# EAGLE design LoRa-E5-Tiny (EAGLE 7.7.0)
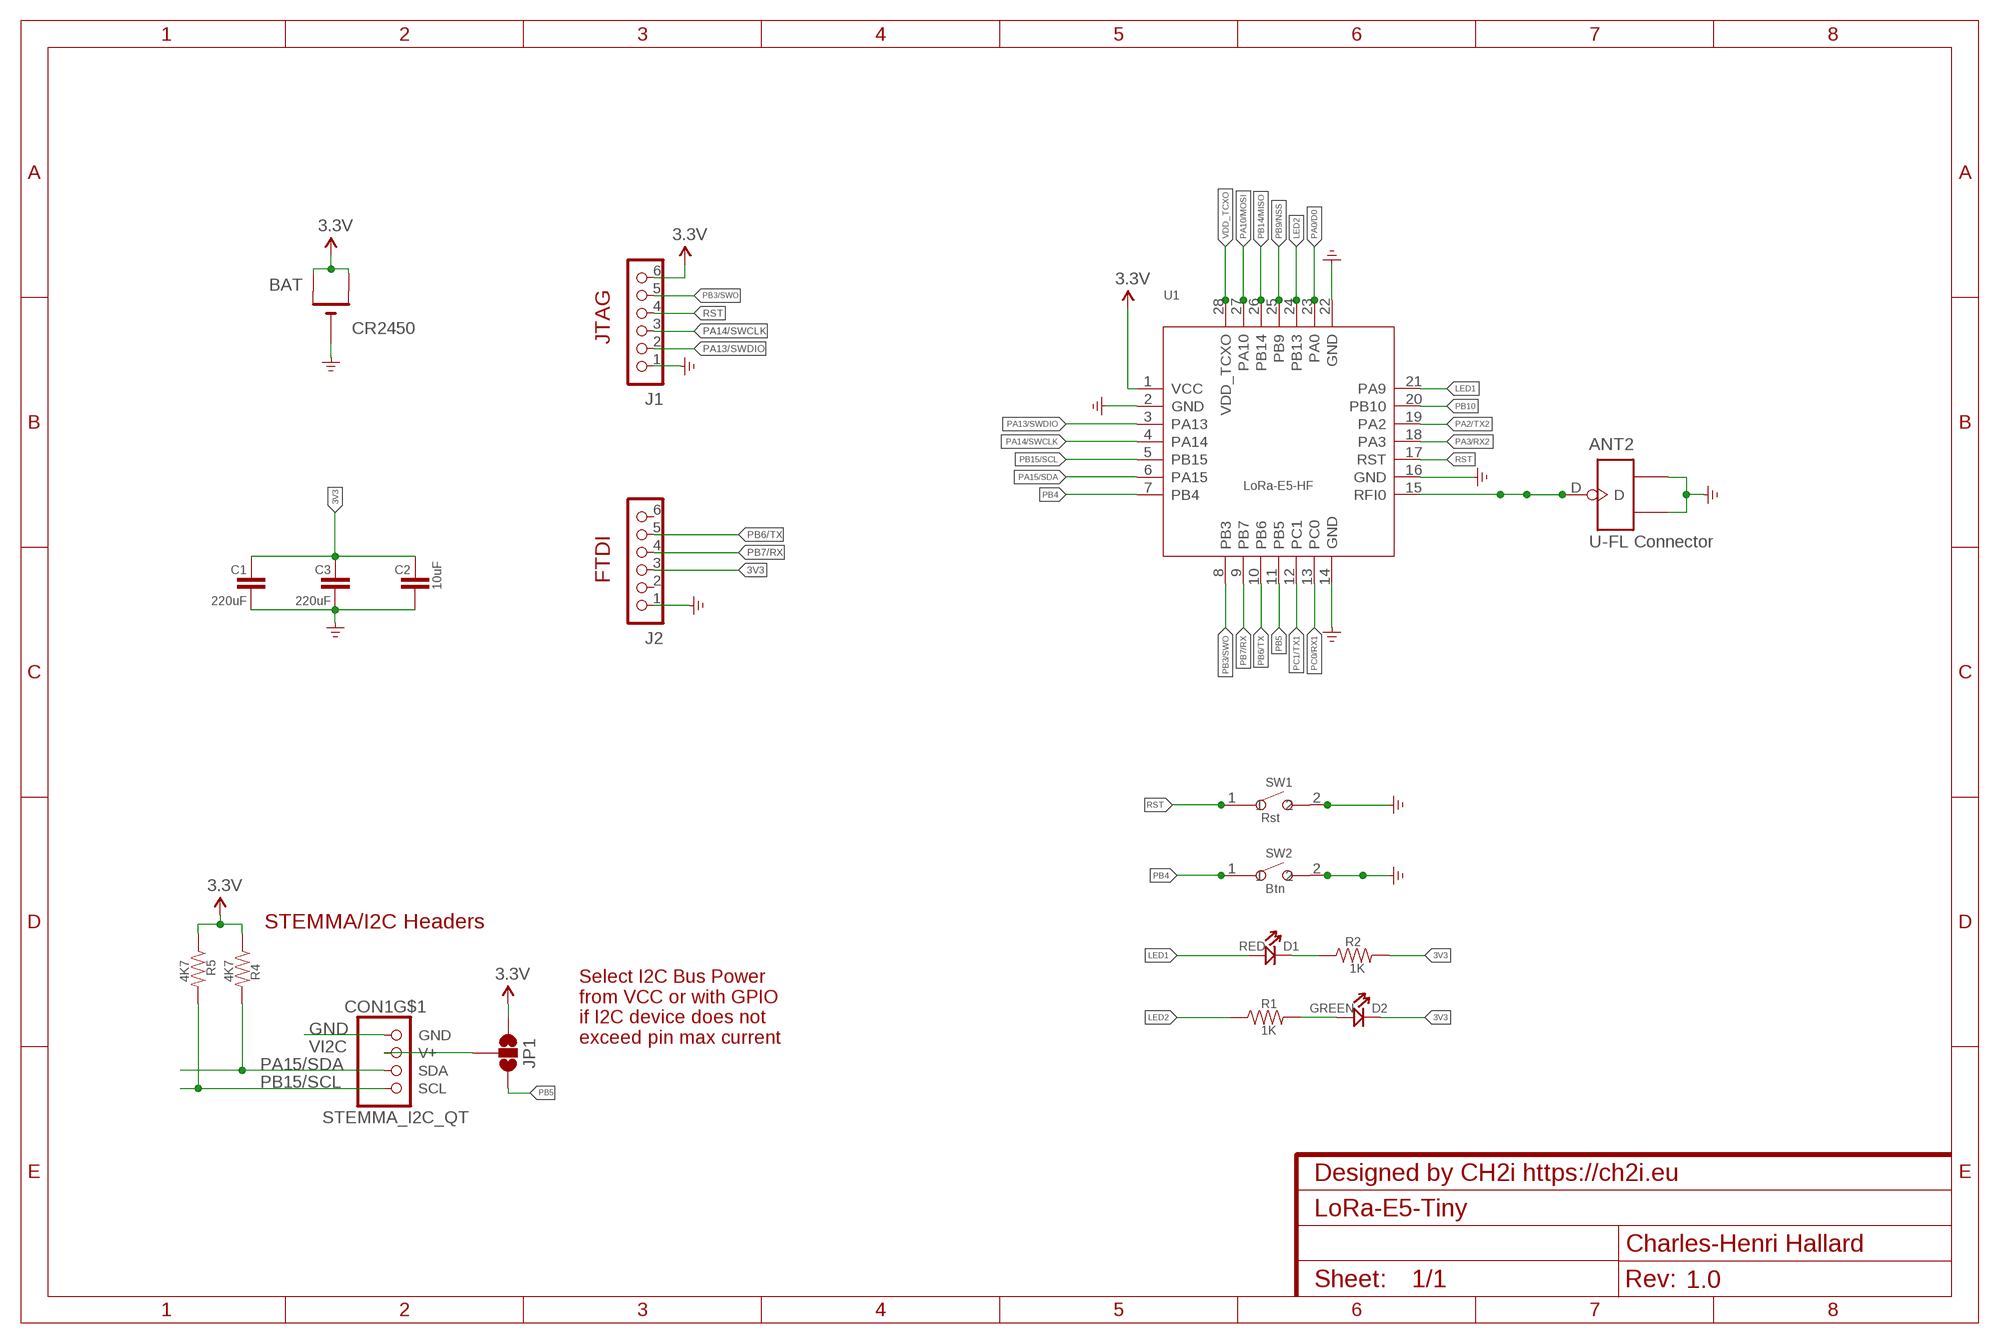
[diagram p0: schematic, sheet 1]
NAME (FRAME-A4L): CNAME: Designed by CH2i https://ch2i.eu; CREVISION: 1.0; DESIGNER: Charles-Henri Hallard

## Parts
ANT2  U-FL Connector  ANTENNA-U-FL-320110048  [U-FL3P-SMD-2.6X2.6X1.0MM]
BAT  CR2450  CR2450THM  [CR2450-THM]
C1  220uF  CAP1206  [1206]
C2  10uF  CAP0603-CAP  [0603-CAP]
C3  220uF  CAP1206  [1206]
CON1  STEMMA_I2C_QT  [JST_SH4]
D1  RED  LED'0805'  [LED-0805]
D2  GREEN  LED'0805'  [LED-0805]
J1  JTAG  CON_HEADER_1X06PAD  [M1X06_PAD]
J2  FTDI  CON_HEADER_1X06PAD  [M1X06_PAD]
JP1  JUMPER-SMT_3_NO_NO-SILK  [SMT-JUMPER_3_NO_NO-SILK]
R1  1K  RESISTOR0603-RES  [0603-RES]
R2  1K  RESISTOR0603-RES  [0603-RES]
R4  4K7  RESISTOR0603-RES  [0603-RES]
R5  4K7  RESISTOR0603-RES  [0603-RES]
SW1  Rst  SMD-BUTTON(2P-3.0X2.5X1.2+0.4MM)-B3U-1000P-2P-SMD  [SW2-2.6-3.0X2.5X1.2+0.4MM]
SW2  Btn  SMD-BUTTON(2P-3.0X2.5X1.2+0.4MM)-B3U-1000P-2P-SMD  [SW2-2.6-3.0X2.5X1.2+0.4MM]
U1  LoRa-E5-HF  MOUDLE_LORA_E5  [MOUDLE28P-1.25-12X12X2.5MM]

## Nets
3V3: BAT.+1(+) BAT.+2(+1) C1.2 C2.2 C3.2 D2.- J1.6 J2.3 JP1.1 R2.2 R4.1 R5.1 U1.1(VCC) ; supply symbol labelled 3.3V
GND: ANT2.GND1 ANT2.GND2 BAT.GND(-) C1.1 C2.1 C3.1 CON1.1(GND) J1.1 J2.1 SW1.2 SW2.2 U1.2(GND) U1.14(GND) U1.16(GND) U1.22(GND) ; supply symbol labelled GND_POWER
LED1: D1.+ U1.21(PA9)
LED2: R1.1 U1.24(PB13)
N$2: D2.+ R1.2
N$12: D1.- R2.1
PA0/D0: U1.23(PA0)
PA2/TX2: U1.19(PA2)
PA3/RX2: U1.18(PA3)
PA10/MOSI: U1.27(PA10)
PA13/SWDIO: J1.2 U1.3(PA13)
PA14/SWCLK: J1.3 U1.4(PA14)
PA15/SDA: CON1.3(SDA) R4.2 U1.6(PA15)
PB3/SWO: J1.5 U1.8(PB3)
PB4: SW2.1 U1.7(PB4)
PB5: JP1.3 U1.11(PB5)
PB6/TX: J2.5 U1.10(PB6)
PB7/RX: J2.4 U1.9(PB7)
PB9/NSS: U1.25(PB9)
PB10: U1.20(PB10)
PB14/MISO: U1.26(PB14)
PB15/SCL: CON1.4(SCL) R5.2 U1.5(PB15)
PC0/RX1: U1.13(PC0)
PC1/TX1: U1.12(PC1)
RF: ANT2.D U1.15(RFI0)
RST: J1.4 SW1.1 U1.17(RST)
VDD_TCXO: U1.28(VDD_TCXO)
VI2C: CON1.2(V+) JP1.2
Unconnected: CON1.MT1(MT) CON1.MT2(MT) J2.2 J2.6

## Notes on the sheet
- JTAG
- FTDI
- STEMMA/I2C Headers
- Select I2C Bus Power
  from VCC or with GPIO
  if I2C device does not
  exceed pin max current

## Library data of the parts
ANT2 = Connector-new:ANTENNA-U-FL
BAT = _c2h:CR2450
C1-C3 = _c2h:CAP: Capacitor Standard 0603 ceramic capacitor, and 0.1" leaded capacitor.
CON1 = microbuilder:STEMMA_I2C
D1 D2 = Discrete-new:LED
J1 J2 = _c2h:CON_HEADER_1X06
JP1 = SparkFun-Jumpers:JUMPER-SMT_3_NO: Normally open jumper This jumper has three pads in close proximity to each other. Apply solder to close the connection(s).
R1 R2 R4 R5 = _c2h:RESISTOR: Resistor Basic schematic elements and footprints for 0603, 1206, and PTH resistors.
SW1 SW2 = Seeed-Switch:SMD-BUTTON(2P-3.0X2.5X1.2+0.4MM): 311020047; MPN: B3U-1000P-2P-SMD; VALUE: B3U-1000P-2P-SMD
U1 = moudle-new:MOUDLE_LORA_E5

## Board
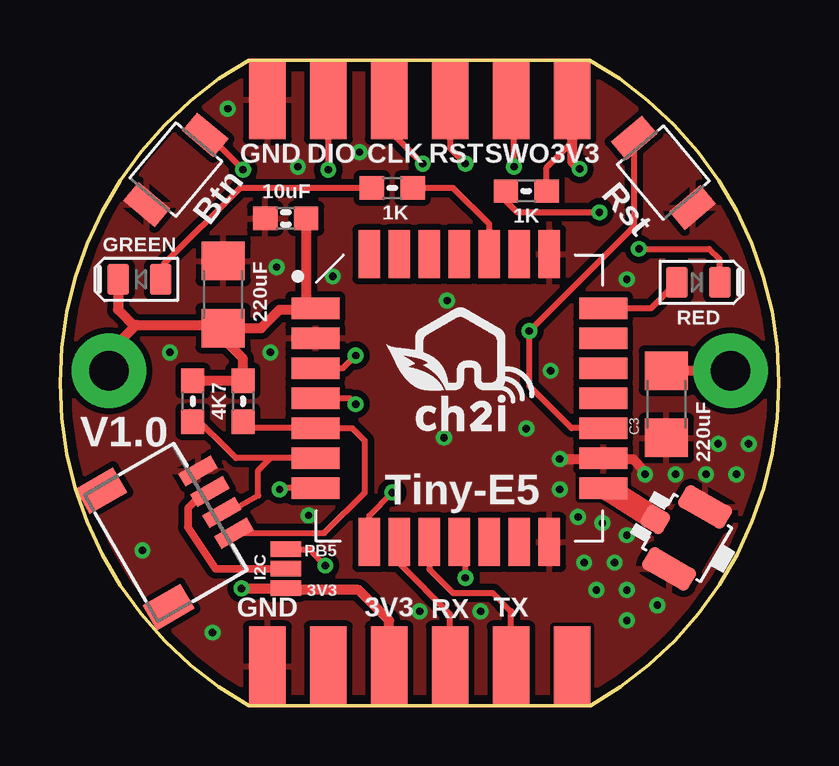
[diagram p1: board, top side]
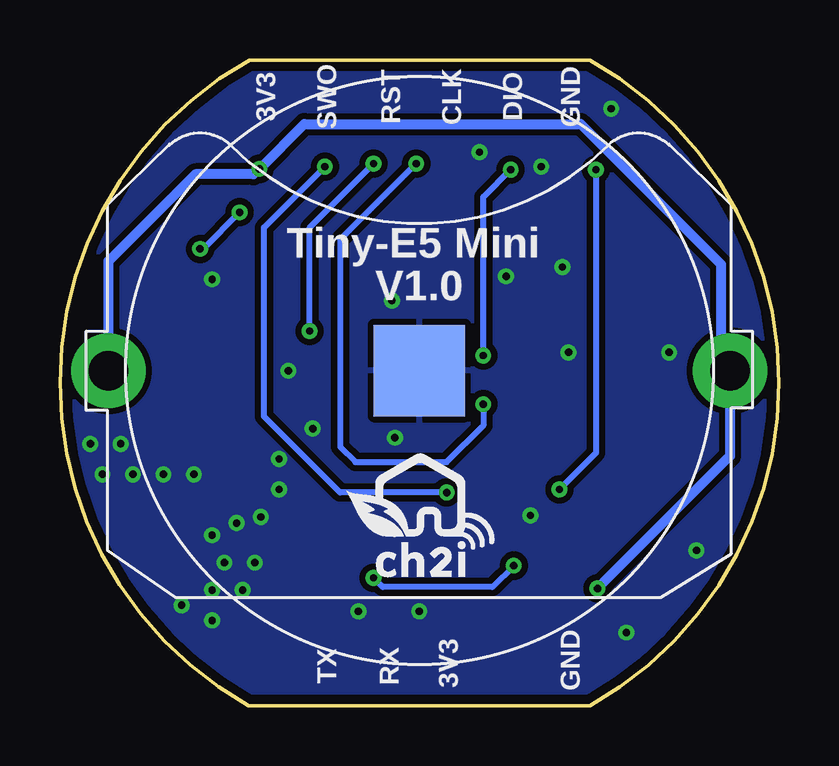
[diagram p2: board, bottom side, seen from below]

Size 29.98 x 26.92 mm. Coordinates in mm from the lower left corner, seen from the top.
Outline: 7.88,0 22.11,0 arc121 22.08,26.92 7.88,26.92 arc121 7.88,0
Copper layers (1*16): Top 0.0356mm / dielectric 1.5011mm / Bottom 0.0356mm
Design rules "oshpark-2layer *": minimum track width 6mil, minimum drill 10mil, track to track 6mil, track to pad 6mil, pad to pad 6mil, via to via 6mil, smd to smd 6mil, copper to edge 15mil, drill to drill 6mil, minimum pad ring 7mil, minimum via ring 7mil, stop-mask expansion 2.5mil, vias tented up to drill 28mil, thermal gap 10mil

### Footprints (pad centres in the part's own frame; a part is rotated, then mirrored left to right if it is on the bottom)
U-FL3P-SMD-2.6X2.6X1.0MM = smd 1.05 x 1: D -1.524,0 | smd 2.2 x 1.05: GND1 0,1.5; GND2 0,-1.5
CR2450-THM = drill 1.651 pad 3.1: +1 -12.954,0; +2 12.954,0 | smd 3.81 x 3.81: GND 0,0
1206 = smd 1.6 x 1.8: 1 -1.4,0; 2 1.4,0
0603-CAP = smd 1.016 x 0.965: 1 -0.85,0; 2 0.85,0
JST_SH4 = smd 0.6 x 1.55: 1 -1.5,2.514; 2 -0.5,2.514; 3 0.5,2.514; 4 1.5,2.514 | smd 1.2 x 1.8: MT1 -2.8,-1.386; MT2 2.8,-1.386
LED-0805 = smd 0.889 x 1.27: + 0.889,0; - -0.889,0
M1X06_PAD = smd 1.524 x 3.302: 1 -6.35,0.129; 2 -3.81,0.129; 3 -1.27,0.129; 4 1.27,0.129; 5 3.81,0.129; 6 6.35,0.129
SMT-JUMPER_3_NO_NO-SILK = smd 0.635 x 1.27: 1 -0.813,0; 2 0,0; 3 0.813,0
0603-RES = smd 1.016 x 0.965: 1 -0.85,0; 2 0.85,0
SW2-2.6-3.0X2.5X1.2+0.4MM = smd 1 x 1.7: 1 -1.9,0; 2 1.9,0
MOUDLE28P-1.25-12X12X2.5MM = smd 2 x 0.9: 1 -6,3.75; 2 -6,2.5; 3 -6,1.25; 4 -6,0; 5 -6,-1.25; 6 -6,-2.5; 7 -6,-3.75; 15 6,-3.75; 16 6,-2.5; 17 6,-1.25; 18 6,0; 19 6,1.25; 20 6,2.5; 21 6,3.75 | smd 0.9 x 2: 8 -3.75,-6; 9 -2.5,-6; 10 -1.25,-6; 11 0,-6; 12 1.25,-6; 13 2.5,-6; 14 3.75,-6; 22 3.75,6; 23 2.5,6; 24 1.25,6; 25 0,6; 26 -1.25,6; 27 -2.5,6; 28 -3.75,6

### Placement (x,y rotation side)
ANT2  26.15,7 330 top
BAT  15,13.97 0 bottom
C1  6.81,17.14 270 top
C2  9.41,20.32 0 top
C3  25.28,12.57 90 top
CON1  4.33,7.24 300 top
D1  26.62,17.66 180 top
D2  3.31,17.78 0 top
J1  15,25.15 0 top
J2  15,1.52 0 top
JP1  9.41,5.71 90 top
R1  13.85,21.59 180 top
R2  19.44,21.46 0 top
R4  5.54,12.7 270 top
R5  7.63,12.7 270 top
SW1  25.16,22.23 310 top
SW2  4.84,22.35 230 top
U1  16.65,12.83 0 top
U$1  [LOGO_C2I_015]  13.6,11.43 0 top
U$2  [LOGO_C2I_015]  18.04,5.33 0 bottom

### Tracks (layer width: path | path; a pad name or v marks a point on that pad's centre or on a via)
3V3  (via drill 0.3)
  Top 0.254: R2.2 20.29,22.44 21.35,23.49 | JP1.1 9.99,4.77 10.04,4.83
  Top 0.406: J2.3 13.73,3.56 12.46,4.83 10.04,4.83 | BAT.+2 2.38,14.19 2.38,15.07 3.12,15.81 | R4.1 R5.1 7.63,14.48 6.87,15.24 6.87,15.68 C1.2 7.5,15.74 | C3.2 BAT.+1 | 7.5,15.74 8.39,15.74 9.15,16.51 10.58,16.51 U1.1 10.26,16.97 C2.2 | 3.12,15.81 3.19,15.87 7.37,15.87 7.5,15.74 | D2.- 2.42,16.51 3.12,15.81 | J1.6 21.35,23.49 21.35,22.7 v21.66,22.38 | v7.57,4.89 9.4,4.89 JP1.1
  Bottom 0.406: BAT.+1 27.95,18.54 24.33,22.16 21.92,22.16 21.7,22.38 v21.66,22.38 19.79,24.26 8.27,24.26 2.42,18.41 2.42,14.35 BAT.+2 2.04,10.41 v7.57,4.89
GND  (via drill 0.3)
  Top 0.406: v20.84,10.29 23.89,10.29 24.39,9.78 v24.39,9.65
  other vias: 21.6,7.87 20.84,9.02 25.66,9.65 26.93,9.65 28.2,9.65 28.71,10.92 22.62,7.62 23.63,7.11 23.12,5.97 23.63,4.83 24.9,4.19 21.85,5.97 22.36,4.83 23.63,3.56 27.44,10.92 10.36,7.94 17.54,3.94 6.36,3.05 3.44,6.48 4.58,14.73 9.03,18.29 11.38,17.91 16.14,16.89 9.92,22.48 8.77,14.73 16.01,11.18 19.44,11.56 12.49,23.08 23.63,17.78 20.46,13.97 7,24.89 15,3.94
  pour Bottom (isolate 0.254): -2.02,27.94 31,27.94 31,-1.27 -2.02,-1.27
  pour Top (isolate 0.254, rank 3): -1.39,27.3 30.36,27.3 30.36,10.79 20.84,10.79 20.84,-0.64 -1.39,-0.64
  pour Top (isolate 0.136): 30.36,-0.64 20.2,-0.64 20.2,10.79 30.36,10.79
LED1
  Top 0.254: U1.21 24.65,16.58 D1.+
LED2
  Top 0.254: U1.24 17.9,20.09 16.39,21.59 R1.1
N$2
  Top 0.254: R1.2 7.5,21.59 4.33,18.41 4.33,17.91 D2.+
N$12  (via drill 0.3)
  Top 0.254: R2.1 18.59,21.04 19.06,20.57 v22.49,20.57 | v24.14,19.05 27.06,19.05 27.51,18.6 D1.-
  Bottom 0.254: v24.14,19.05 24.01,19.05 v22.49,20.57
PA13/SWDIO  (via drill 0.3)
  Top 0.254: U1.3 11.8,14.08 v12.33,14.6 | J1.2 v11.19,22.35
  Bottom 0.254: v12.33,14.6 12.33,21.21 v11.19,22.35
PA14/SWCLK  (via drill 0.3)
  Top 0.254: U1.4 12.08,12.83 v12.33,12.57 | J1.3 13.73,24 v15.12,22.61
  Bottom 0.254: v12.33,12.57 12.33,11.68 13.85,10.16 17.66,10.16 18.3,10.79 18.3,19.43 v15.12,22.61
PA15/SDA
  Top 0.254: U1.6 8.77,10.33 | 8.77,10.33 7.34,10.33 5.41,12.26 R4.2 | CON1.3 6.8,7.94 8.27,8.76 8.27,9.82 8.77,10.33
PB3/SWO  (via drill 0.3)
  Top 0.254: U1.8 12.9,7.93 v13.85,8.89 | v18.93,22.48 18.93,25.15 J1.5
  Bottom 0.254: v13.85,8.89 18.3,8.89 21.47,12.06 21.47,19.94 v18.93,22.48
PB4  (via drill 0.3)
  Top 0.254: SW2.1 6.18,23.81 v7.63,22.35 | v9.15,9.02 9.22,9.08 U1.7
  Bottom 0.254: v7.63,22.35 7.63,10.54 v9.15,9.02
PB5  (via drill 0.3)
  Top 0.254: JP1.3 10.44,6.53 v11.06,5.84 | v16.9,5.33 16.9,6.57 U1.11
  Bottom 0.254: v11.06,5.84 11.95,4.95 16.52,4.95 v16.9,5.33
PB6/TX
  Top 0.254: U1.10 15.4,5.69 16.39,4.7 18.04,4.7 18.81,3.94 J2.5
PB7/RX
  Top 0.254: U1.9 14.15,5.93 16.27,3.81 J2.4
PB15/SCL
  Top 0.254: CON1.4 11.02,7.2 12.71,8.89 12.71,11.05 12.18,11.58 U1.5 8.03,11.58 R5.2
RF
  Top 0.254: 22.87,9.02 22.71,9.02 U1.15
  Top 1: ANT2.D 22.87,9.02
RST  (via drill 0.3)
  Top 0.254: U1.17 21.33,11.58 19.57,13.33 v19.57,15.62 23.94,19.99 SW1.1 | J1.4 16.27,23.24 v16.9,22.61
  Bottom 0.254: v19.57,15.62 19.57,19.94 v16.9,22.61
VI2C
  Top 0.305: JP1.2 6.49,5.71 5.32,7.45 5.34,7.47 5.34,8.26 6.02,8.93 CON1.2

### Text on the board
tPlace: V1.0 | Tiny-E5 | PB5 | I2C | 3V3
bPlace: Tiny-E5 Mini | V1.0
tNames: GND | DIO | CLK | RST | SWO | 3V3 | GND | 3V3 | RX | TX
bNames: GND | DIO | CLK | RST | SWO | 3V3 | GND | 3V3 | RX | TX
tTest: U1